# Altium project PCB_Project2.PrjPCB
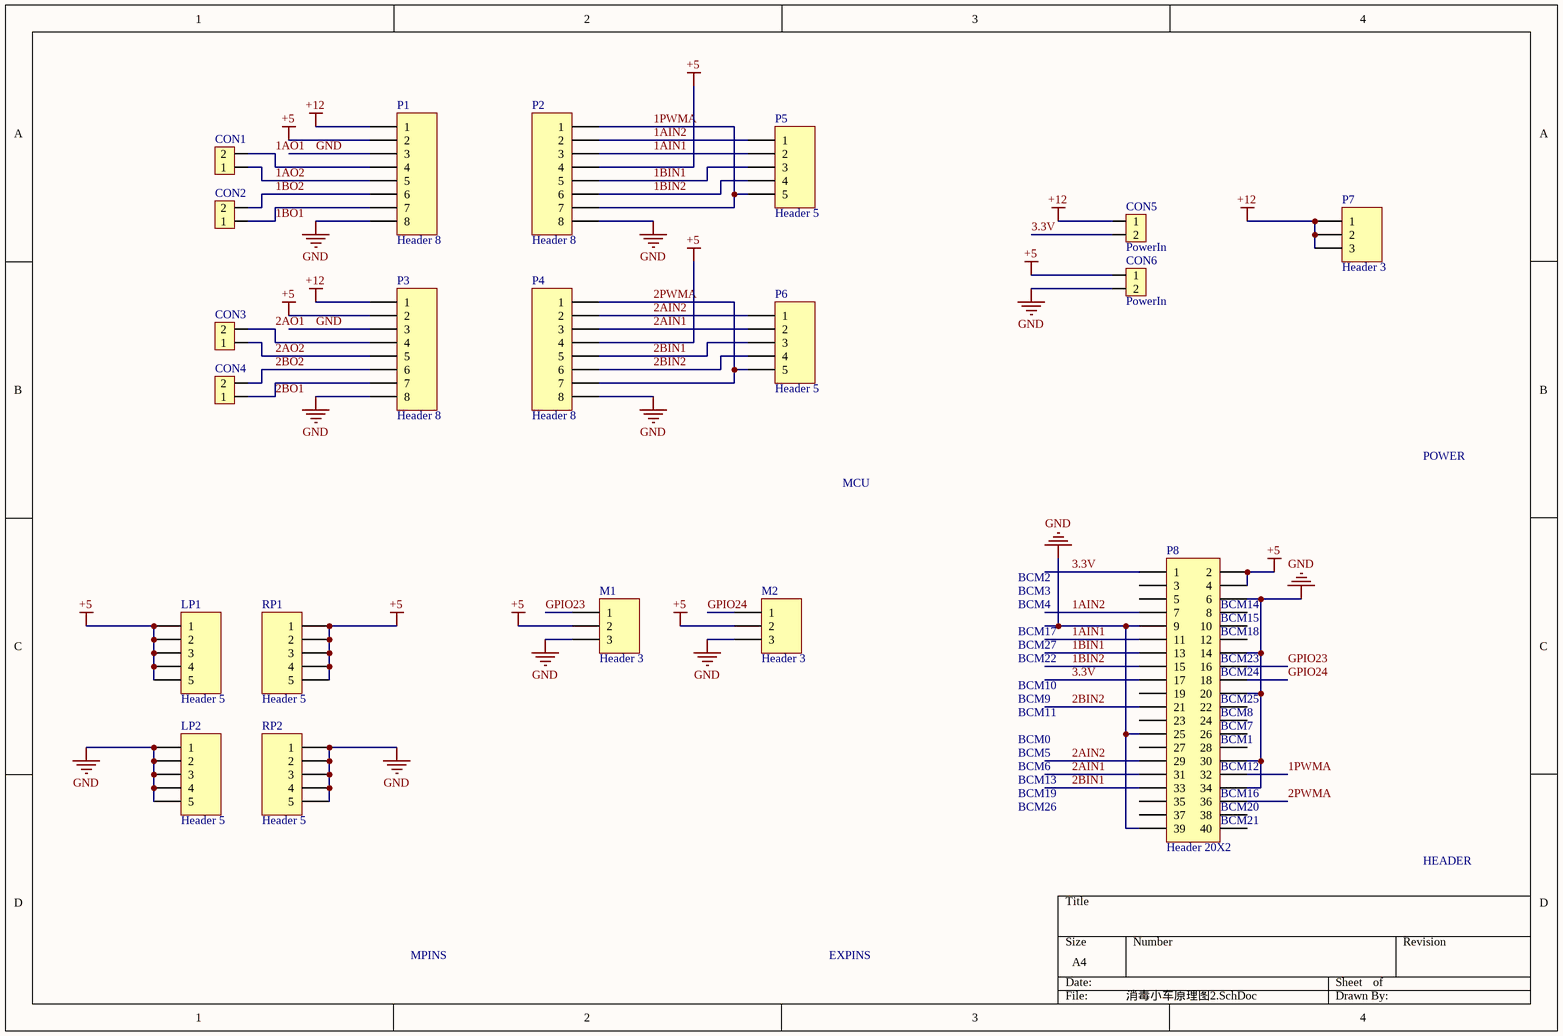
[diagram p0: 消毒小车原理图2.SchDoc]
1 sheet, 20 parts. Net scope: global (net labels, ports and power ports of the same name join across sheets).
Board file: 消毒小车PCB2.PcbDoc

## Sheet 消毒小车原理图2.SchDoc
size A4

### Parts
CON1  PowerIn  [KF301-2P]  (value not drawn)
CON2  PowerIn  [KF301-2P]  (value not drawn)
CON3  PowerIn  [KF301-2P]  (value not drawn)
CON4  PowerIn  [KF301-2P]  (value not drawn)
CON5  PowerIn  [KF301-2P]
CON6  PowerIn  [KF301-2P]
LP1  Header 5  [HDR1X5]
LP2  Header 5  [HDR1X5]
M1  Header 3  [HDR1X3]
M2  Header 3  [HDR1X3]
P1  Header 8  [HDR1X8]
P2  Header 8  [HDR1X8]
P3  Header 8  [HDR1X8]
P4  Header 8  [HDR1X8]
P5  Header 5  [HDR1X5]
P6  Header 5  [HDR1X5]
P7  Header 3  [HDR1X3]
P8  Header 20X2  [HDR2X20]
RP1  Header 5  [HDR1X5]
RP2  Header 5  [HDR1X5]

### Nets
+5: CON6.1 LP1.1 LP1.2 LP1.3 LP1.4 LP1.5 M1.2 M2.2 P1.2 P2.4 P3.2 P4.4 P8.2 P8.4 RP1.1 RP1.2 RP1.3 RP1.4 RP1.5
+12: CON5.1 P1.1 P3.1 P7.1 P7.2 P7.3
GND: CON6.2 LP2.1 LP2.2 LP2.3 LP2.4 LP2.5 M1.3 M2.3 P1.3 P1.8 P2.8 P3.3 P3.8 P4.8 P8.6 P8.9 P8.14 P8.20 P8.25 P8.30 P8.34 P8.39 RP2.1 RP2.2 RP2.3 RP2.4 RP2.5
1AIN1: P2.3 P5.2 P8.11
1AIN2: P2.2 P5.1 P8.7
1AO1: CON1.2 P1.4
1AO2: CON1.1 P1.5
1BIN1: P2.5 P5.3 P8.13
1BIN2: P2.6 P5.4 P8.15
1BO1: CON2.1 P1.7
1BO2: CON2.2 P1.6
1PWMA: P2.1 P2.7 P5.5 P8.32
2AIN1: P4.3 P6.2 P8.31
2AIN2: P4.2 P6.1 P8.29
2AO1: CON3.2 P3.4
2AO2: CON3.1 P3.5
2BIN1: P4.5 P6.3 P8.33
2BIN2: P4.6 P6.4 P8.21
2BO1: CON4.1 P3.7
2BO2: CON4.2 P3.6
2PWMA: P4.1 P4.7 P6.5 P8.36
3.3V: CON5.2 P8.1 P8.17
GPIO23: M1.1 P8.16
GPIO24: M2.1 P8.18

Not connected (* = marked no-connect by the designer): P8 3 5 8 10 12 19 22 23 24 26 27 28 35 37 38 40

### Notes on the sheet
- MCU
- POWER
- BCM2
- BCM27
- BCM17
- BCM4
- BCM3
- (near P8) BCM14
- (near P8) BCM15
- (near P8) BCM18
- BCM11
- BCM9
- BCM10
- BCM22
- (near P8) BCM23
- (near P8) BCM24
- (near P8) BCM25
- (near P8) BCM8
- BCM13
- BCM6
- BCM5
- BCM0
- (near P8) BCM7
- (near P8) BCM1
- (near P8) BCM12
- BCM26
- BCM19
- (near P8) BCM16
- (near P8) BCM20
- (near P8) BCM21
- HEADER
- MPINS
- EXPINS

### Library data of the parts
CON1-CON6 = Header 2: Header, 2-Pin
LP1 LP2 P5 P6 RP1 RP2 = Header 5: Header, 5-Pin; LatestRevisionDate: 17-Jul-2002; LatestRevisionNote: Re-released for DXP Platform.; Publisher: Altium Limited
M1 M2 P7 = Header 3: Header, 3-Pin; LatestRevisionDate: 17-Jul-2002; LatestRevisionNote: Re-released for DXP Platform.; Publisher: Altium Limited
P1-P4 = Header 8: Header, 8-Pin; LatestRevisionDate: 17-Jul-2002; LatestRevisionNote: Re-released for DXP Platform.; Publisher: Altium Limited
P8 = Header 20X2: Header, 20-Pin, Dual row; LatestRevisionDate: 17-Jul-2002; LatestRevisionNote: Re-released for DXP Platform.; Publisher: Altium Limited